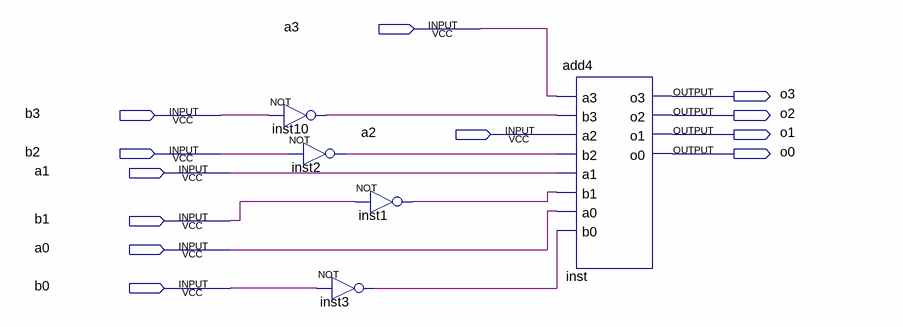
[diagram p0: schematic sheet]
// Quartus schematic lab41vn.bdf as structural Verilog: 5 symbols, 12 pins
module lab41vn (
  input  a3,
  input  b3,
  input  a2,
  input  b2,
  input  a1,
  input  b1,
  input  a0,
  input  b0,
  output o3,
  output o2,
  output o1,
  output o0
);

  wire inst1_out, inst2_out, inst3_out, inst10_out;

  not inst10 (inst10_out, b3);
  not inst2 (inst2_out, b2);
  not inst3 (inst3_out, b0);
  not inst1 (inst1_out, b1);
  add4 inst (
    .a3(a3), .b3(inst10_out), .a2(a2), .b2(inst2_out), .a1(a1), .b1(inst1_out), .a0(a0), .b0(inst3_out),
    .o3(o3), .o2(o2), .o1(o1), .o0(o0));
endmodule
